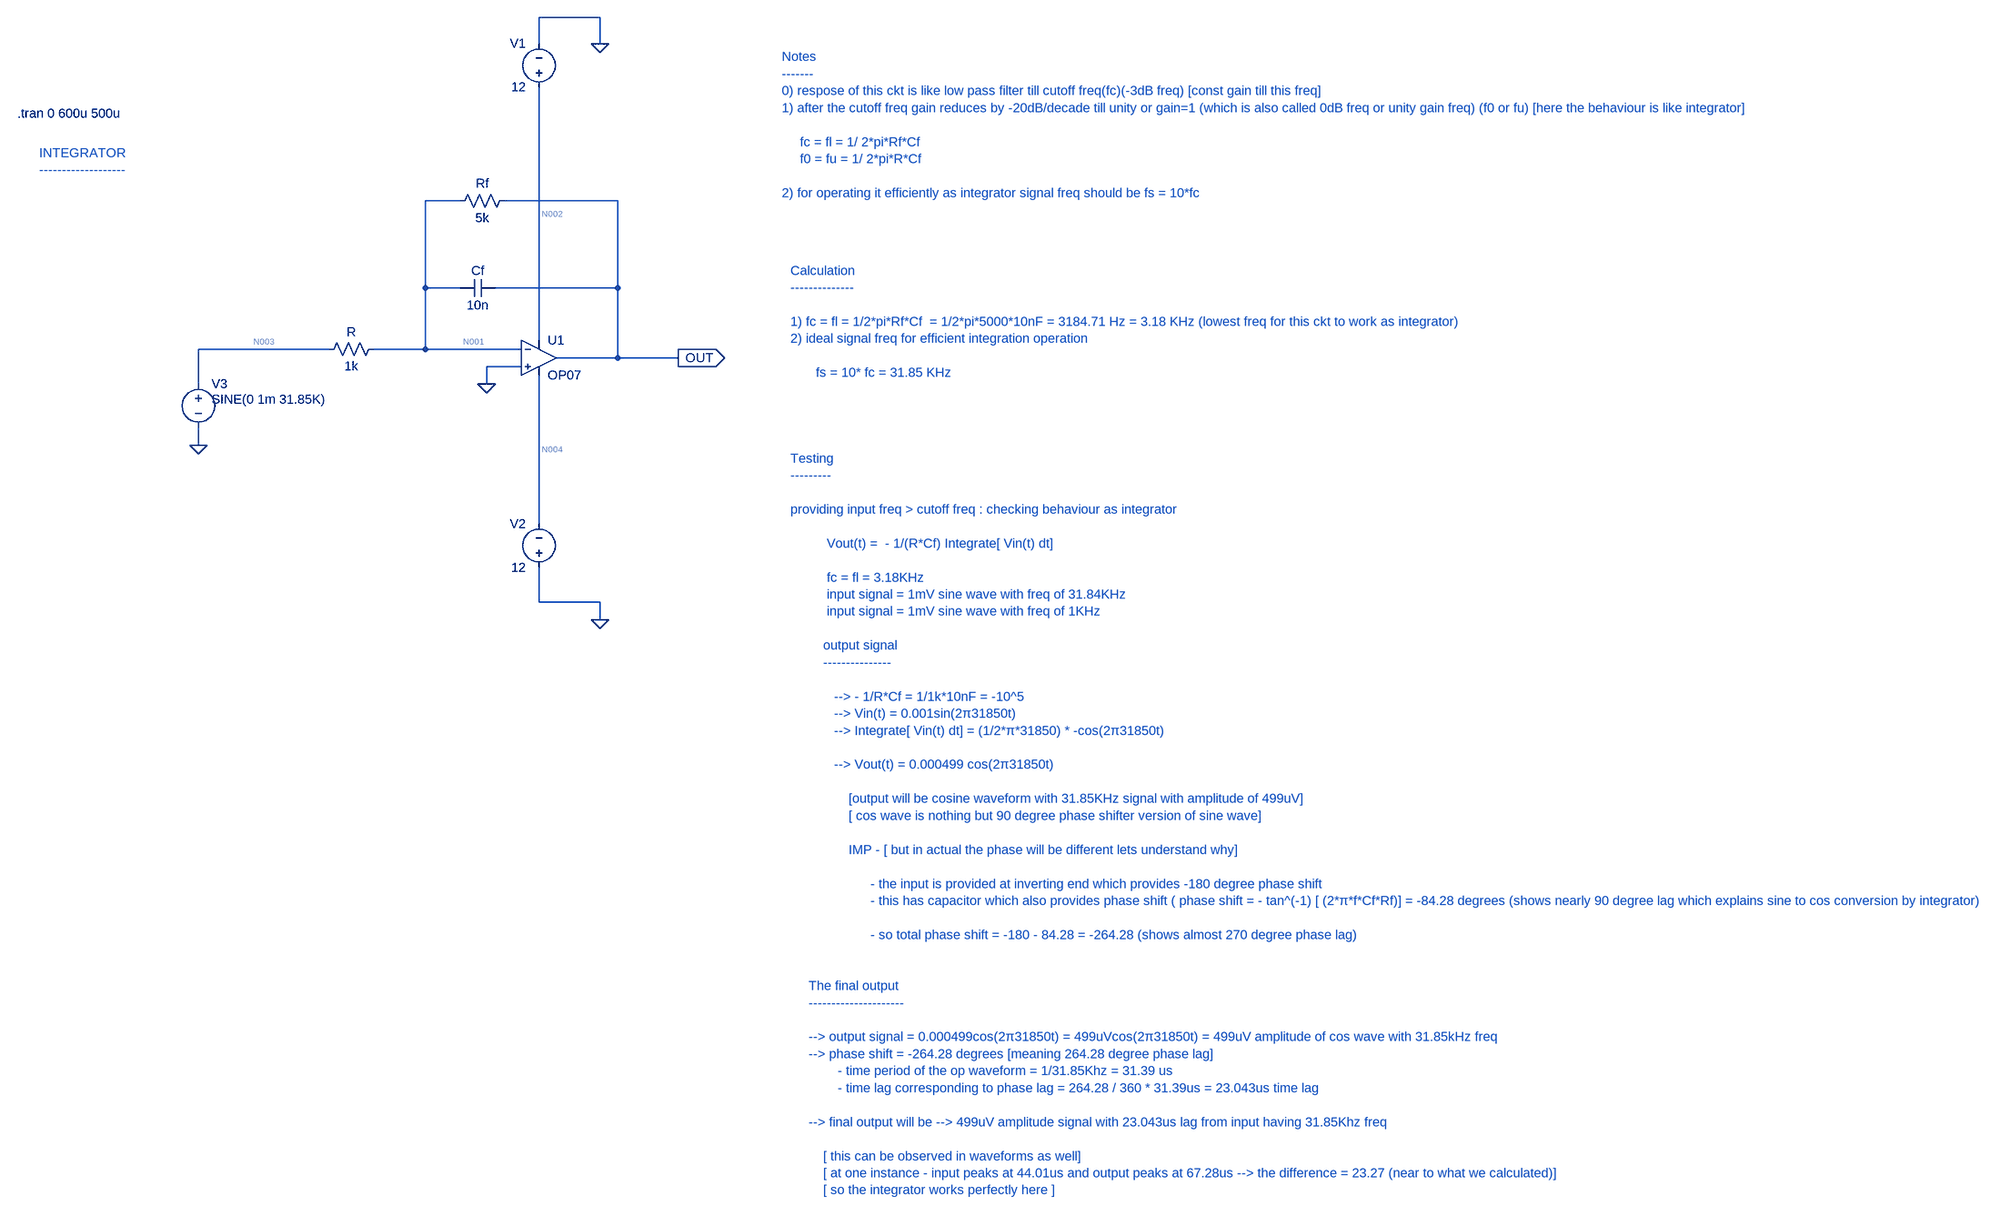
[diagram p0: schematic Op_amp_as_INTEGRATOR_with_AC_input_with_freq_greater_than_cutoff_freq.asc]
Op_amp_as_INTEGRATOR_with_AC_input_with_freq_greater_than_cutoff_freq.asc, the LTspice schematic file:
Version 4.1
SHEET 1 3496 1680
WIRE 192 -544 80 -544
WIRE 80 -496 80 -544
WIRE 192 -496 192 -544
WIRE -64 -208 -128 -208
WIRE 224 -208 16 -208
WIRE -128 -48 -128 -208
WIRE -64 -48 -128 -48
WIRE 224 -48 224 -208
WIRE 224 -48 0 -48
WIRE 80 48 80 -416
WIRE -304 64 -544 64
WIRE -128 64 -128 -48
WIRE -128 64 -224 64
WIRE 48 64 -128 64
WIRE 224 80 224 -48
WIRE 224 80 112 80
WIRE 352 80 224 80
WIRE 48 96 -16 96
WIRE -544 128 -544 64
WIRE -16 128 -16 96
WIRE -544 240 -544 208
WIRE 80 384 80 112
WIRE 80 528 80 464
WIRE 192 528 80 528
WIRE 192 560 192 528
FLAG 192 -496 0
FLAG 192 560 0
FLAG -544 240 0
FLAG 352 80 OUT
IOPIN 352 80 Out
FLAG -16 128 0
SYMBOL voltage 80 -400 R180
WINDOW 0 24 96 Left 2
WINDOW 3 24 16 Left 2
WINDOW 123 0 0 Left 0
WINDOW 39 0 0 Left 0
SYMATTR InstName V1
SYMATTR Value 12
SYMBOL voltage 80 480 R180
WINDOW 0 24 96 Left 2
WINDOW 3 24 16 Left 2
WINDOW 123 0 0 Left 0
WINDOW 39 0 0 Left 0
SYMATTR InstName V2
SYMATTR Value 12
SYMBOL OpAmps\\OP07 80 16 R0
SYMATTR InstName U1
SYMBOL res -208 48 R90
WINDOW 0 0 56 VBottom 2
WINDOW 3 32 56 VTop 2
SYMATTR InstName R
SYMATTR Value 1k
SYMBOL voltage -544 112 R0
WINDOW 123 0 0 Left 0
WINDOW 39 0 0 Left 0
WINDOW 3 24 44 Left 2
SYMATTR Value SINE(0 1m 31.85K)
SYMATTR InstName V3
SYMBOL cap 0 -64 R90
WINDOW 0 0 32 VBottom 2
WINDOW 3 32 32 VTop 2
SYMATTR InstName Cf
SYMATTR Value 10n
SYMBOL res 32 -224 R90
WINDOW 0 0 56 VBottom 2
WINDOW 3 32 56 VTop 2
SYMATTR InstName Rf
SYMATTR Value 5k
TEXT -1264 -368 Left 2 !.tran 0 600u 500u
TEXT -1224 -296 Left 2 ;INTEGRATOR\n-------------------
TEXT 1072 -472 Left 2 ;Notes\n-------\n0) respose of this ckt is like low pass filter till cutoff freq(fc)(-3dB freq) [const gain till this freq]\n1) after the cutoff freq gain reduces by -20dB/decade till unity or gain=1 (which is also called 0dB freq or unity gain freq) (f0 or fu) [here the behaviour is like integrator]\n     \n     fc = fl = 1/ 2*pi*Rf*Cf \n     f0 = fu = 1/ 2*pi*R*Cf \n \n2) for operating it efficiently as integrator signal freq should be fs = 10*fc
TEXT 1088 -80 Left 2 ;Calculation\n--------------\n \n1) fc = fl = 1/2*pi*Rf*Cf  = 1/2*pi*5000*10nF = 3184.71 Hz = 3.18 KHz (lowest freq for this ckt to work as integrator)\n2) ideal signal freq for efficient integration operation\n \n       fs = 10* fc = 31.85 KHz
TEXT 1088 264 Left 2 ;Testing\n---------\n \nproviding input freq > cutoff freq : checking behaviour as integrator\n   \n          Vout(t) =  - 1/(R*Cf) Integrate[ Vin(t) dt]\n \n          fc = fl = 3.18KHz \n          input signal = 1mV sine wave with freq of 31.84KHz\n          input signal = 1mV sine wave with freq of 1KHz\n    \n         output signal \n         ---------------\n \n            --> - 1/R*Cf = 1/1k*10nF = -10^5\n            --> Vin(t) = 0.001sin(2π31850t)\n            --> Integrate[ Vin(t) dt] = (1/2*π*31850) * -cos(2π31850t)\n       \n            --> Vout(t) = 0.000499 cos(2π31850t)\n \n                [output will be cosine waveform with 31.85KHz signal with amplitude of 499uV]\n                [ cos wave is nothing but 90 degree phase shifter version of sine wave]\n                \n                IMP - [ but in actual the phase will be different lets understand why]\n                      \n                      - the input is provided at inverting end which provides -180 degree phase shift\n                      - this has capacitor which also provides phase shift ( phase shift = - tan^(-1) [ (2*π*f*Cf*Rf)] = -84.28 degrees (shows nearly 90 degree lag which explains sine to cos conversion by integrator)\n                      \n                      - so total phase shift = -180 - 84.28 = -264.28 (shows almost 270 degree phase lag)\n \n \n     The final output\n     ---------------------\n    \n     --> output signal = 0.000499cos(2π31850t) = 499uVcos(2π31850t) = 499uV amplitude of cos wave with 31.85kHz freq\n     --> phase shift = -264.28 degrees [meaning 264.28 degree phase lag]\n             - time period of the op waveform = 1/31.85Khz = 31.39 us\n             - time lag corresponding to phase lag = 264.28 / 360 * 31.39us = 23.043us time lag \n \n     --> final output will be --> 499uV amplitude signal with 23.043us lag from input having 31.85Khz freq\n         \n         [ this can be observed in waveforms as well]\n         [ at one instance - input peaks at 44.01us and output peaks at 67.28us --> the difference = 23.27 (near to what we calculated)]\n         [ so the integrator works perfectly here ]

The netlist it stands for:
* Op_amp_as_INTEGRATOR_with_AC_input_with_freq_greater_than_cutoff_freq.asc
V1 N002 0 12
V2 0 N004 12
X§U1 0 N001 N002 N004 OUT LT1001  ; OP07, pins In+ In- V+ V- OUT
R N001 N003 1k
V3 N003 0 SINE(0 1m 31.85K)
Cf OUT N001 10n
Rf OUT N001 5k
.tran 0 600u 500u
* INTEGRATOR
* -------------------
* Notes
* -------
* 0) respose of this ckt is like low pass filter till cutoff freq(fc)(-3dB freq) [const gain till this freq]
* 1) after the cutoff freq gain reduces by -20dB/decade till unity or gain=1 (which is also called 0dB freq or unity gain freq) (f0 or fu) [here the behaviour is like integrator]
*      fc = fl = 1/ 2*pi*Rf*Cf
*      f0 = fu = 1/ 2*pi*R*Cf
* 2) for operating it efficiently as integrator signal freq should be fs = 10*fc
* Calculation
* --------------
* 1) fc = fl = 1/2*pi*Rf*Cf  = 1/2*pi*5000*10nF = 3184.71 Hz = 3.18 KHz (lowest freq for this ckt to work as integrator)
* 2) ideal signal freq for efficient integration operation
*        fs = 10* fc = 31.85 KHz
* Testing
* ---------
* providing input freq > cutoff freq : checking behaviour as integrator
*           Vout(t) =  - 1/(R*Cf) Integrate[ Vin(t) dt]
*           fc = fl = 3.18KHz
*           input signal = 1mV sine wave with freq of 31.84KHz
*           input signal = 1mV sine wave with freq of 1KHz
*          output signal
*          ---------------
*             --> - 1/R*Cf = 1/1k*10nF = -10^5
*             --> Vin(t) = 0.001sin(2π31850t)
*             --> Integrate[ Vin(t) dt] = (1/2*π*31850) * -cos(2π31850t)
*             --> Vout(t) = 0.000499 cos(2π31850t)
*                 [output will be cosine waveform with 31.85KHz signal with amplitude of 499uV]
*                 [ cos wave is nothing but 90 degree phase shifter version of sine wave]
*                 IMP - [ but in actual the phase will be different lets understand why]
*                       - the input is provided at inverting end which provides -180 degree phase shift
*                       - this has capacitor which also provides phase shift ( phase shift = - tan^(-1) [ (2*π*f*Cf*Rf)] = -84.28 degrees (shows nearly 90 degree lag which explains sine to cos conversion by integrator)
*                       - so total phase shift = -180 - 84.28 = -264.28 (shows almost 270 degree phase lag)
*      The final output
*      ---------------------
*      --> output signal = 0.000499cos(2π31850t) = 499uVcos(2π31850t) = 499uV amplitude of cos wave with 31.85kHz freq
*      --> phase shift = -264.28 degrees [meaning 264.28 degree phase lag]
*              - time period of the op waveform = 1/31.85Khz = 31.39 us
*              - time lag corresponding to phase lag = 264.28 / 360 * 31.39us = 23.043us time lag
*      --> final output will be --> 499uV amplitude signal with 23.043us lag from input having 31.85Khz freq
*          [ this can be observed in waveforms as well]
*          [ at one instance - input peaks at 44.01us and output peaks at 67.28us --> the difference = 23.27 (near to what we calculated)]
*          [ so the integrator works perfectly here ]
.lib LTC.lib
.backanno
.end

* Results of the author's LTspice run, read from the files saved beside the schematic
* Operating Point, zero values left out:
*   V(n004) = -12 V
*   V(n002) = 12 V
*   I(V1) = -2.25 mA
*   I(V2) = -2.25 mA
*   Ix(u1:3) = 2.25 mA
*   Ix(u1:4) = -2.25 mA
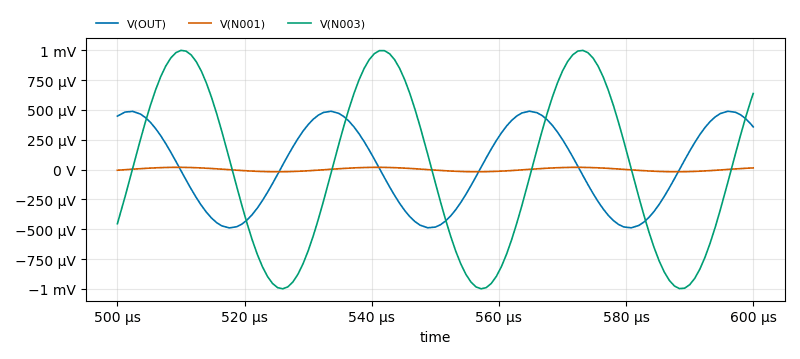
[diagram p1: Transient Analysis of Op_amp_as_INTEGRATOR_with_AC_input_with_freq_greater_than_cutoff_freq.asc, plotted from the saved traces]
* Transient Analysis, 1 run:
*   V(OUT): min -489.4 µV, max 489.2 µV, average 26.22 µV, rms 353 µV, last 357.9 µV
*   V(N001): min -18.41 µV, max 18.4 µV, average 263.8 nV, rms 12.77 µV, last 13.79 µV
*   V(N003): min -999.8 µV, max 999.2 µV, average 6.021 µV, rms 691.9 µV, last 637.4 µV